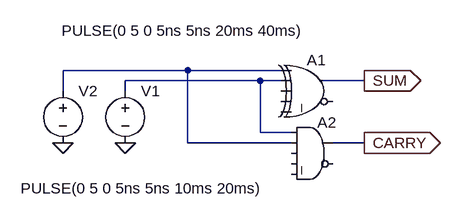
[diagram p0: schematic Halfaddr.asc]
Halfaddr.asc, the LTspice schematic file:
Version 4
SHEET 1 880 680
WIRE 128 96 -64 96
WIRE 272 96 128 96
WIRE 240 112 32 112
WIRE 272 112 240 112
WIRE 400 112 336 112
WIRE -64 128 -64 96
WIRE 32 128 32 112
WIRE 240 192 240 112
WIRE 288 192 240 192
WIRE 128 208 128 96
WIRE 288 208 128 208
WIRE 400 208 352 208
FLAG 32 208 0
FLAG -64 208 0
FLAG 400 112 SUM
IOPIN 400 112 Out
FLAG 400 208 CARRY
IOPIN 400 208 Out
SYMBOL Digital\\xor 320 64 R0
SYMATTR InstName A1
SYMBOL Digital\\and 320 160 R0
SYMATTR InstName A2
SYMBOL voltage 32 112 R0
WINDOW 3 -161 166 Left 2
WINDOW 123 0 0 Left 0
WINDOW 39 0 0 Left 0
SYMATTR InstName V1
SYMATTR Value PULSE(0 5 0 5ns 5ns 10ms 20ms)
SYMBOL voltage -64 112 R0
WINDOW 3 -2 -77 Left 2
WINDOW 123 0 0 Left 0
WINDOW 39 0 0 Left 0
SYMATTR InstName V2
SYMATTR Value PULSE(0 5 0 5ns 5ns 20ms 40ms)

The netlist it stands for:
* Halfaddr.asc
A1 N001 N002 0 0 0 0 SUM 0 XOR
A2 N002 N001 0 0 0 0 CARRY 0 AND
V1 N002 0 PULSE(0 5 0 5ns 5ns 10ms 20ms)
V2 N001 0 PULSE(0 5 0 5ns 5ns 20ms 40ms)
.backanno
.end